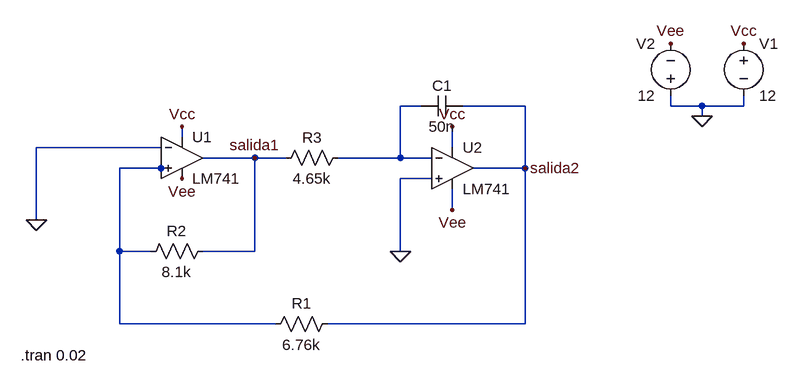
[diagram p0: schematic Generador de onda triangular (con valores practicos).asc]
Generador de onda triangular (con valores practicos).asc, the LTspice schematic file:
Version 4
SHEET 1 880 680
WIRE 320 80 288 80
WIRE 480 80 384 80
WIRE 704 80 704 64
WIRE 752 80 704 80
WIRE 816 80 816 64
WIRE 816 80 752 80
WIRE 752 96 752 80
WIRE -48 128 -48 112
WIRE -80 144 -272 144
WIRE 368 144 368 112
WIRE 64 160 -16 160
WIRE 112 160 64 160
WIRE 288 160 288 80
WIRE 288 160 192 160
WIRE 336 160 288 160
WIRE -80 176 -144 176
WIRE -64 176 -80 176
WIRE 480 176 480 80
WIRE 480 176 400 176
WIRE 336 192 288 192
WIRE 368 240 368 208
WIRE -272 256 -272 144
WIRE -144 304 -144 176
WIRE -96 304 -144 304
WIRE 64 304 64 160
WIRE 64 304 -16 304
WIRE 288 304 288 192
WIRE -144 416 -144 304
WIRE 96 416 -144 416
WIRE 480 416 480 176
WIRE 480 416 176 416
FLAG -272 256 0
FLAG 288 304 0
FLAG 752 96 0
FLAG 816 -16 Vcc
FLAG -48 112 Vcc
FLAG 368 112 Vcc
FLAG 704 -16 Vee
FLAG -48 192 Vee
FLAG 368 240 Vee
FLAG 64 160 salida1
FLAG 480 176 salida2
SYMBOL res 208 144 R90
WINDOW 0 0 56 VBottom 2
WINDOW 3 32 56 VTop 2
SYMATTR InstName R3
SYMATTR Value 4.65k
SYMBOL res 0 288 R90
WINDOW 0 0 56 VBottom 2
WINDOW 3 32 56 VTop 2
SYMATTR InstName R2
SYMATTR Value 8.1k
SYMBOL res 192 400 R90
WINDOW 0 0 56 VBottom 2
WINDOW 3 32 56 VTop 2
SYMATTR InstName R1
SYMATTR Value 6.76k
SYMBOL voltage 816 -32 R0
WINDOW 123 0 0 Left 2
WINDOW 39 0 0 Left 2
SYMATTR InstName V1
SYMATTR Value 12
SYMBOL voltage 704 80 R180
WINDOW 0 24 96 Left 2
WINDOW 3 24 16 Left 2
WINDOW 123 0 0 Left 2
WINDOW 39 0 0 Left 2
SYMATTR InstName V2
SYMATTR Value 12
SYMBOL cap 384 64 R90
WINDOW 0 0 32 VBottom 2
WINDOW 3 32 32 VTop 2
SYMATTR InstName C1
SYMATTR Value 50n
SYMBOL Opamps\\LM741 -48 96 R0
SYMATTR InstName U1
SYMBOL Opamps\\LM741 368 112 R0
SYMATTR InstName U2
TEXT -296 464 Left 2 !.tran 0.02

The netlist it stands for:
* Generador de onda triangular (con valores practicos).asc
R3 N001 salida1 4.65k
R2 salida1 N002 8.1k
R1 salida2 N002 6.76k
V1 Vcc 0 12
V2 0 Vee 12
C1 salida2 N001 50n
XU1 N002 0 Vcc Vee salida1 LM741  ; pins In+ In- V+ V- OUT
XU2 0 N001 Vcc Vee salida2 LM741  ; pins In+ In- V+ V- OUT
.tran 0.02
.lib LM741.lib
.backanno
.end